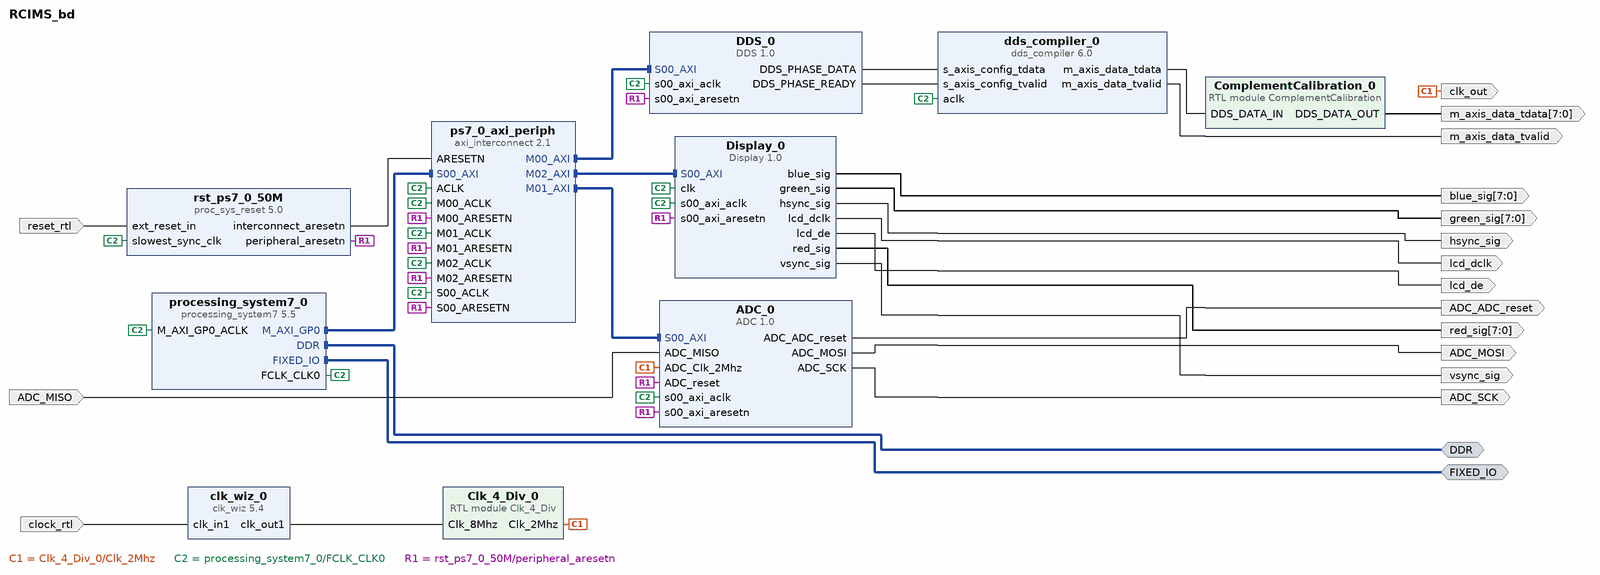
[diagram p0: block diagram of the top level]
# Vivado block design RCIMS_bd, xc7z010clg400-1, Vivado 2017.2
create_bd_design RCIMS_bd

create_bd_intf_port -mode Master -vlnv xilinx.com:interface:ddrx_rtl:1.0 DDR
create_bd_intf_port -mode Master -vlnv xilinx.com:display_processing_system7:fixedio_rtl:1.0 FIXED_IO
create_bd_port -dir O -type rst ADC_ADC_reset
create_bd_port -dir O ADC_MOSI
create_bd_port -dir O ADC_SCK
create_bd_port -dir I ADC_MISO
create_bd_port -dir O -type clk clk_out
create_bd_port -dir O -from 7 -to 0 m_axis_data_tdata
create_bd_port -dir O -from 7 -to 0 blue_sig
create_bd_port -dir O -from 7 -to 0 green_sig
create_bd_port -dir O hsync_sig
create_bd_port -dir O lcd_dclk
create_bd_port -dir O lcd_de
create_bd_port -dir O -from 7 -to 0 red_sig
create_bd_port -dir O vsync_sig
create_bd_port -dir I -type clk clock_rtl
set_property -dict {CONFIG.FREQ_HZ 50000000 CONFIG.PHASE 0.000} [get_bd_ports clock_rtl]
create_bd_port -dir O m_axis_data_tvalid
create_bd_port -dir I -type rst reset_rtl
set_property -dict {CONFIG.POLARITY ACTIVE_LOW} [get_bd_ports reset_rtl]

create_bd_cell -type ip -vlnv xilinx.com:user:ADC:1.0 ADC_0
create_bd_cell -type ip -vlnv xilinx.com:user:DDS:1.0 DDS_0
create_bd_cell -type ip -vlnv xilinx.com:user:Display:1.0 Display_0
create_bd_cell -type ip -vlnv xilinx.com:ip:clk_wiz:5.4 clk_wiz_0
set_property -dict [list \
  CONFIG.PRIMITIVE MMCM \
  CONFIG.USE_FREQ_SYNTH true \
  CONFIG.PRIM_IN_FREQ 50.000 \
  CONFIG.CLKIN1_JITTER_PS 200.0 \
  CONFIG.CLKOUT1_REQUESTED_OUT_FREQ 8 \
  CONFIG.CLKOUT1_DRIVES BUFG \
  CONFIG.CLKOUT2_DRIVES BUFG \
  CONFIG.CLKOUT3_DRIVES BUFG \
  CONFIG.CLKOUT4_DRIVES BUFG \
  CONFIG.CLKOUT5_DRIVES BUFG \
  CONFIG.CLKOUT6_DRIVES BUFG \
  CONFIG.CLKOUT7_DRIVES BUFG \
  CONFIG.FEEDBACK_SOURCE FDBK_AUTO \
  CONFIG.USE_LOCKED false \
  CONFIG.USE_RESET false \
  CONFIG.MMCM_DIVCLK_DIVIDE 1 \
  CONFIG.MMCM_CLKFBOUT_MULT_F 17.500 \
  CONFIG.MMCM_CLKIN1_PERIOD 20.000 \
  CONFIG.MMCM_CLKIN2_PERIOD 10.0 \
  CONFIG.MMCM_COMPENSATION ZHOLD \
  CONFIG.MMCM_CLKOUT0_DIVIDE_F 109.375 \
  CONFIG.CLKOUT1_JITTER 308.663 \
  CONFIG.CLKOUT1_PHASE_ERROR 151.172 \
] [get_bd_cells clk_wiz_0]
create_bd_cell -type ip -vlnv xilinx.com:ip:dds_compiler:6.0 dds_compiler_0
set_property -dict [list \
  CONFIG.DDS_Clock_Rate 50 \
  CONFIG.Parameter_Entry Hardware_Parameters \
  CONFIG.Noise_Shaping None \
  CONFIG.Phase_Width 31 \
  CONFIG.Output_Width 8 \
  CONFIG.Phase_Increment Programmable \
  CONFIG.Output_Selection Cosine \
  CONFIG.Has_Phase_Out false \
  CONFIG.DATA_Has_TLAST Not_Required \
  CONFIG.S_PHASE_Has_TUSER Not_Required \
  CONFIG.M_DATA_Has_TUSER Not_Required \
  CONFIG.Latency 3 \
  CONFIG.Output_Frequency1 0 \
  CONFIG.PINC1 1000011000111 \
] [get_bd_cells dds_compiler_0]
create_bd_cell -type ip -vlnv xilinx.com:ip:processing_system7:5.5 processing_system7_0
set_property -dict [list \
  CONFIG.PCW_UIPARAM_DDR_PARTNO {MT41J128M16 HA-125} \
  CONFIG.PCW_UART1_PERIPHERAL_ENABLE 1 \
  CONFIG.PCW_UART1_UART1_IO {MIO 48 .. 49} \
] [get_bd_cells processing_system7_0]
create_bd_cell -type ip -vlnv xilinx.com:ip:axi_interconnect:2.1 ps7_0_axi_periph
set_property -dict {CONFIG.NUM_MI 3} [get_bd_cells ps7_0_axi_periph]
create_bd_cell -type ip -vlnv xilinx.com:ip:proc_sys_reset:5.0 rst_ps7_0_50M
create_bd_cell -type module -reference Clk_4_Div Clk_4_Div_0
create_bd_cell -type module -reference ComplementCalibration ComplementCalibration_0

# ---- connections ----

connect_bd_intf_net [get_bd_intf_pins processing_system7_0/M_AXI_GP0] [get_bd_intf_pins ps7_0_axi_periph/S00_AXI]
connect_bd_intf_net [get_bd_intf_pins ps7_0_axi_periph/M00_AXI] [get_bd_intf_pins DDS_0/S00_AXI]
connect_bd_intf_net [get_bd_intf_pins ps7_0_axi_periph/M01_AXI] [get_bd_intf_pins ADC_0/S00_AXI]
connect_bd_intf_net [get_bd_intf_pins ps7_0_axi_periph/M02_AXI] [get_bd_intf_pins Display_0/S00_AXI]
connect_bd_intf_net [get_bd_intf_ports DDR] [get_bd_intf_pins processing_system7_0/DDR]
connect_bd_intf_net [get_bd_intf_ports FIXED_IO] [get_bd_intf_pins processing_system7_0/FIXED_IO]
connect_bd_net [get_bd_pins ADC_0/ADC_ADC_reset] [get_bd_ports ADC_ADC_reset]
connect_bd_net [get_bd_pins ADC_0/ADC_MOSI] [get_bd_ports ADC_MOSI]
connect_bd_net [get_bd_pins ADC_0/ADC_SCK] [get_bd_ports ADC_SCK]
connect_bd_net [get_bd_ports ADC_MISO] [get_bd_pins ADC_0/ADC_MISO]
connect_bd_net [get_bd_pins Clk_4_Div_0/Clk_2Mhz] [get_bd_ports clk_out] [get_bd_pins ADC_0/ADC_Clk_2Mhz]
connect_bd_net [get_bd_pins ComplementCalibration_0/DDS_DATA_OUT] [get_bd_ports m_axis_data_tdata]
connect_bd_net [get_bd_pins DDS_0/DDS_PHASE_DATA] [get_bd_pins dds_compiler_0/s_axis_config_tdata]
connect_bd_net [get_bd_pins DDS_0/DDS_PHASE_READY] [get_bd_pins dds_compiler_0/s_axis_config_tvalid]
connect_bd_net [get_bd_pins Display_0/blue_sig] [get_bd_ports blue_sig]
connect_bd_net [get_bd_pins Display_0/green_sig] [get_bd_ports green_sig]
connect_bd_net [get_bd_pins Display_0/hsync_sig] [get_bd_ports hsync_sig]
connect_bd_net [get_bd_pins Display_0/lcd_dclk] [get_bd_ports lcd_dclk]
connect_bd_net [get_bd_pins Display_0/lcd_de] [get_bd_ports lcd_de]
connect_bd_net [get_bd_pins Display_0/red_sig] [get_bd_ports red_sig]
connect_bd_net [get_bd_pins Display_0/vsync_sig] [get_bd_ports vsync_sig]
connect_bd_net [get_bd_pins clk_wiz_0/clk_out1] [get_bd_pins Clk_4_Div_0/Clk_8Mhz]
connect_bd_net [get_bd_ports clock_rtl] [get_bd_pins clk_wiz_0/clk_in1]
connect_bd_net [get_bd_pins dds_compiler_0/m_axis_data_tdata] [get_bd_pins ComplementCalibration_0/DDS_DATA_IN]
connect_bd_net [get_bd_pins dds_compiler_0/m_axis_data_tvalid] [get_bd_ports m_axis_data_tvalid]
connect_bd_net [get_bd_pins processing_system7_0/FCLK_CLK0] \
  [get_bd_pins dds_compiler_0/aclk] [get_bd_pins processing_system7_0/M_AXI_GP0_ACLK] \
  [get_bd_pins rst_ps7_0_50M/slowest_sync_clk] [get_bd_pins DDS_0/s00_axi_aclk] [get_bd_pins ADC_0/s00_axi_aclk] \
  [get_bd_pins Display_0/s00_axi_aclk] [get_bd_pins Display_0/clk] [get_bd_pins ps7_0_axi_periph/S00_ACLK] \
  [get_bd_pins ps7_0_axi_periph/M00_ACLK] [get_bd_pins ps7_0_axi_periph/ACLK] [get_bd_pins ps7_0_axi_periph/M01_ACLK] \
  [get_bd_pins ps7_0_axi_periph/M02_ACLK]
connect_bd_net [get_bd_ports reset_rtl] [get_bd_pins rst_ps7_0_50M/ext_reset_in]
connect_bd_net [get_bd_pins rst_ps7_0_50M/interconnect_aresetn] [get_bd_pins ps7_0_axi_periph/ARESETN]
connect_bd_net [get_bd_pins rst_ps7_0_50M/peripheral_aresetn] \
  [get_bd_pins DDS_0/s00_axi_aresetn] [get_bd_pins ADC_0/ADC_reset] [get_bd_pins ADC_0/s00_axi_aresetn] \
  [get_bd_pins Display_0/s00_axi_aresetn] [get_bd_pins ps7_0_axi_periph/S00_ARESETN] \
  [get_bd_pins ps7_0_axi_periph/M00_ARESETN] [get_bd_pins ps7_0_axi_periph/M01_ARESETN] \
  [get_bd_pins ps7_0_axi_periph/M02_ARESETN]

# ---- address map ----
assign_bd_address -offset 0x43C00000 -range 64K -target_address_space [get_bd_addr_spaces processing_system7_0/Data] [get_bd_addr_segs DDS_0/S00_AXI/S00_AXI_reg]
assign_bd_address -offset 0x43C10000 -range 64K -target_address_space [get_bd_addr_spaces processing_system7_0/Data] [get_bd_addr_segs ADC_0/S00_AXI/S00_AXI_reg]
assign_bd_address -offset 0x43C20000 -range 64K -target_address_space [get_bd_addr_spaces processing_system7_0/Data] [get_bd_addr_segs Display_0/S00_AXI/S00_AXI_reg]

validate_bd_design
save_bd_design
